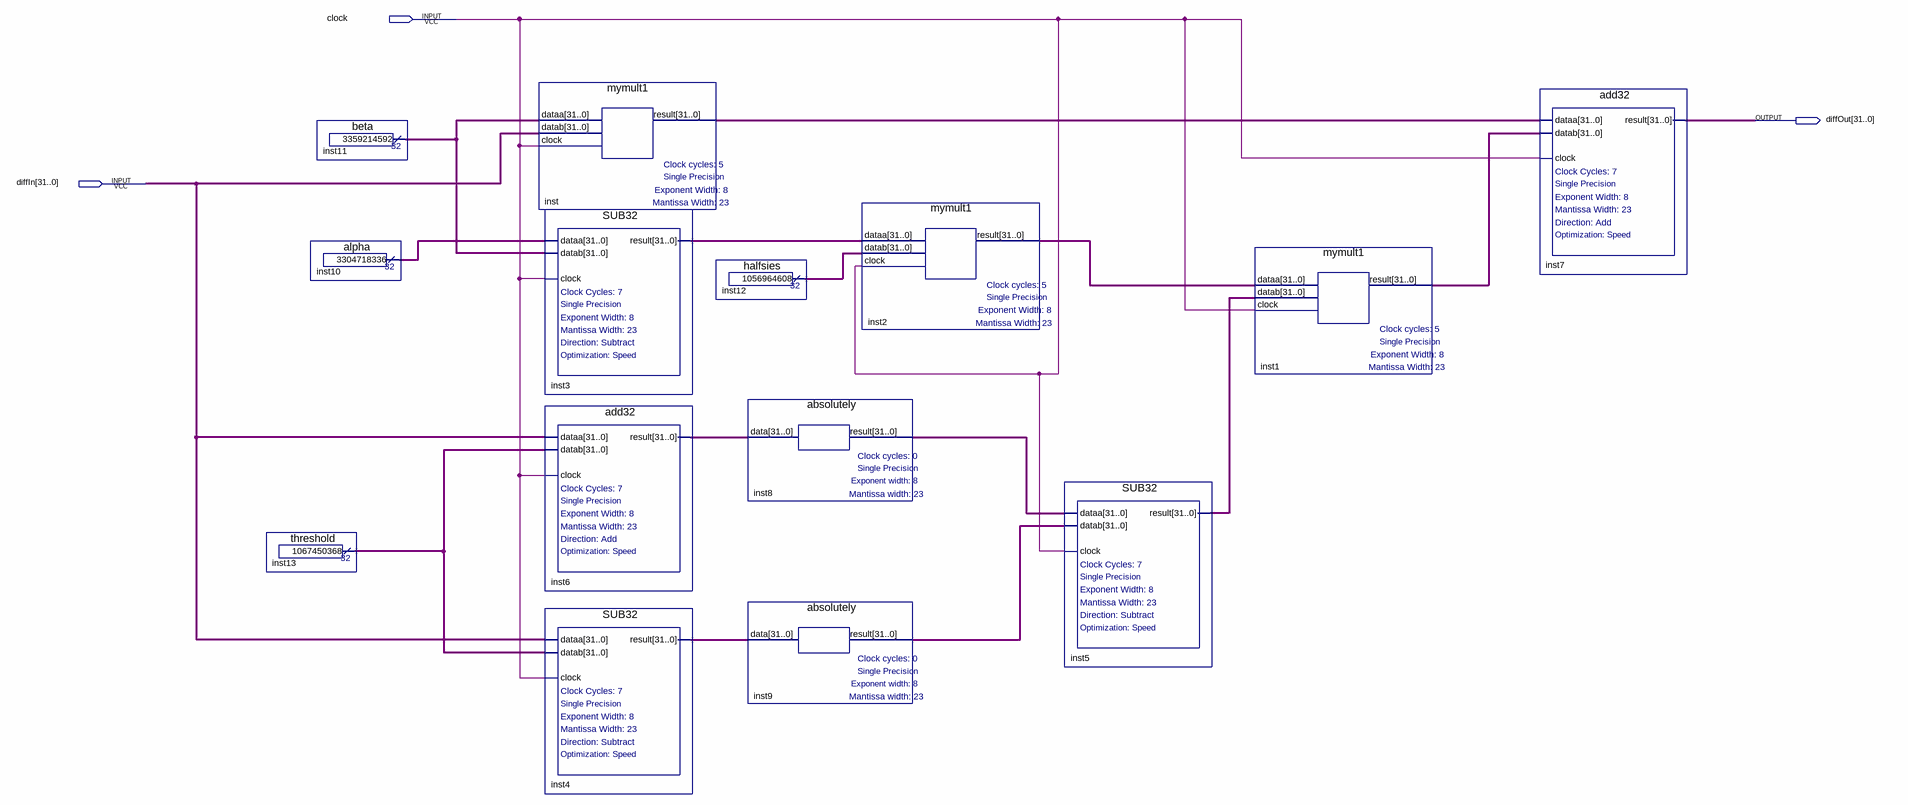
[diagram p0: schematic sheet]
// Quartus schematic diff.bdf as structural Verilog: 14 symbols, 3 pins
module diff (
  input  clock,
  input  [31:0] diffIn,
  output [31:0] diffOut
);

  wire [31:0] inst1_result, inst2_result, inst3_result, inst4_result, inst5_result, inst6_result,
       inst8_result, inst9_result, inst10_result, inst11_result, inst12_result, inst13_result, inst_result;

  threshold inst13 (.result(inst13_result));
  beta inst11 (.result(inst11_result));
  alpha inst10 (.result(inst10_result));
  mymult1 inst (.dataa(inst11_result), .datab(diffIn), .clock(clock), .result(inst_result));
  SUB32 inst3 (.dataa(inst10_result), .datab(inst11_result), .clock(clock), .result(inst3_result));
  add32 inst6 (.dataa(diffIn), .datab(inst13_result), .clock(clock), .result(inst6_result));
  SUB32 inst4 (.dataa(diffIn), .datab(inst13_result), .clock(clock), .result(inst4_result));
  halfsies inst12 (.result(inst12_result));
  absolutely inst8 (.data(inst6_result), .result(inst8_result));
  absolutely inst9 (.data(inst4_result), .result(inst9_result));
  mymult1 inst2 (.dataa(inst3_result), .datab(inst12_result), .clock(clock), .result(inst2_result));
  SUB32 inst5 (.dataa(inst8_result), .datab(inst9_result), .clock(clock), .result(inst5_result));
  mymult1 inst1 (.dataa(inst2_result), .datab(inst5_result), .clock(clock), .result(inst1_result));
  add32 inst7 (.dataa(inst_result), .datab(inst1_result), .clock(clock), .result(diffOut));
endmodule
